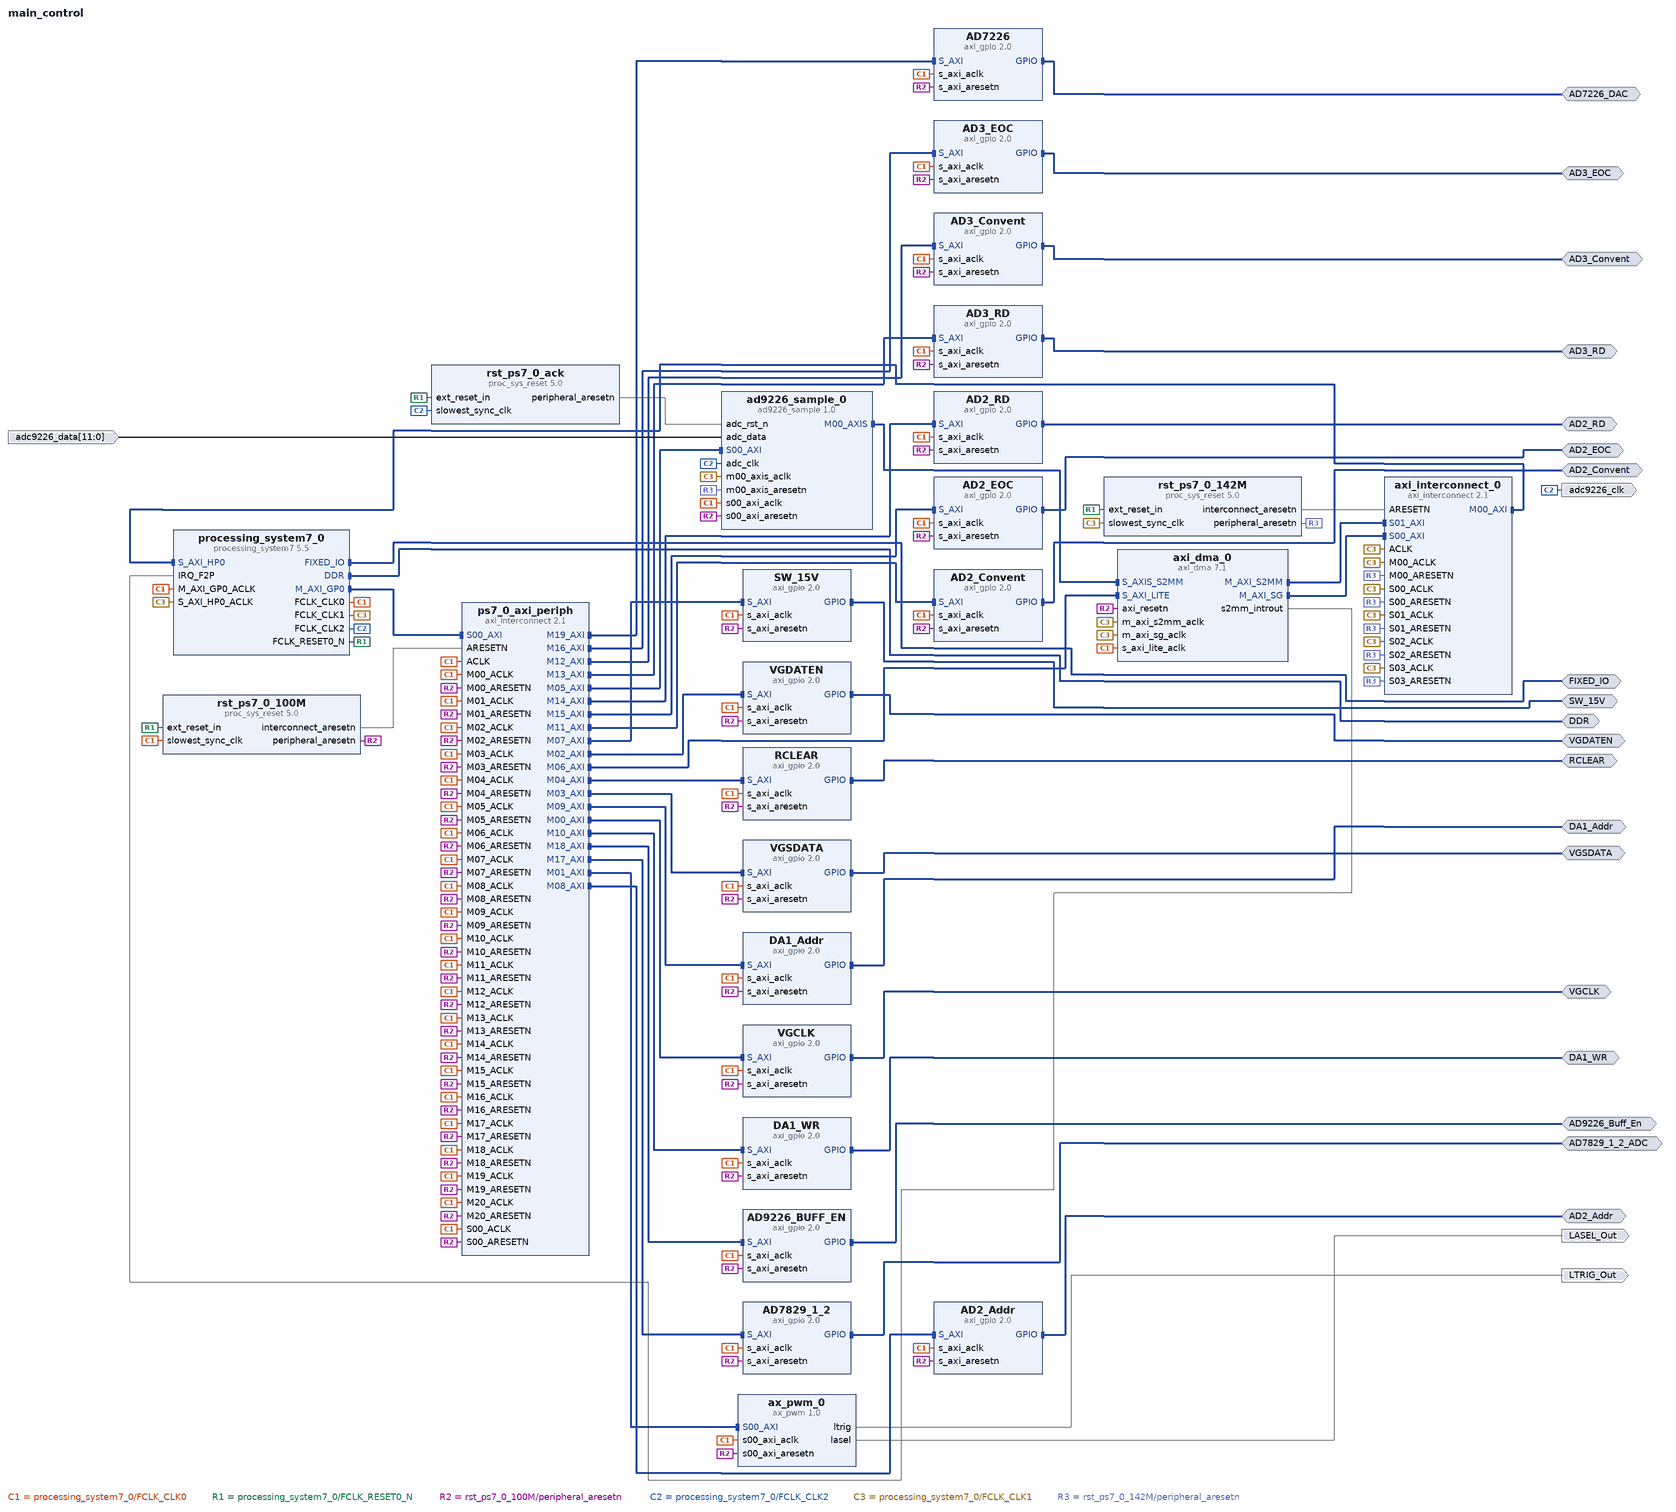
[diagram p0: block diagram of the top level]
# Vivado block design main_control, xc7z020clg484-2, Vivado 2018.3
create_bd_design main_control

create_bd_intf_port -mode Master -vlnv xilinx.com:interface:ddrx_rtl:1.0 DDR
create_bd_intf_port -mode Master -vlnv xilinx.com:display_processing_system7:fixedio_rtl:1.0 FIXED_IO
create_bd_intf_port -mode Master -vlnv xilinx.com:interface:gpio_rtl:1.0 VGCLK
create_bd_intf_port -mode Master -vlnv xilinx.com:interface:gpio_rtl:1.0 VGDATEN
create_bd_intf_port -mode Master -vlnv xilinx.com:interface:gpio_rtl:1.0 VGSDATA
create_bd_intf_port -mode Master -vlnv xilinx.com:interface:gpio_rtl:1.0 RCLEAR
create_bd_intf_port -mode Master -vlnv xilinx.com:interface:gpio_rtl:1.0 SW_15V
create_bd_intf_port -mode Master -vlnv xilinx.com:interface:gpio_rtl:1.0 AD2_Addr
create_bd_intf_port -mode Master -vlnv xilinx.com:interface:gpio_rtl:1.0 DA1_Addr
create_bd_intf_port -mode Master -vlnv xilinx.com:interface:gpio_rtl:1.0 DA1_WR
create_bd_intf_port -mode Master -vlnv xilinx.com:interface:gpio_rtl:1.0 AD2_Convent
create_bd_intf_port -mode Master -vlnv xilinx.com:interface:gpio_rtl:1.0 AD2_RD
create_bd_intf_port -mode Master -vlnv xilinx.com:interface:gpio_rtl:1.0 AD2_EOC
create_bd_intf_port -mode Master -vlnv xilinx.com:interface:gpio_rtl:1.0 AD3_RD
create_bd_intf_port -mode Master -vlnv xilinx.com:interface:gpio_rtl:1.0 AD3_EOC
create_bd_intf_port -mode Master -vlnv xilinx.com:interface:gpio_rtl:1.0 AD3_Convent
create_bd_intf_port -mode Master -vlnv xilinx.com:interface:gpio_rtl:1.0 AD7226_DAC
create_bd_intf_port -mode Master -vlnv xilinx.com:interface:gpio_rtl:1.0 AD7829_1_2_ADC
create_bd_intf_port -mode Master -vlnv xilinx.com:interface:gpio_rtl:1.0 AD9226_Buff_En
create_bd_port -dir I -from 11 -to 0 adc9226_data
create_bd_port -dir O -type clk adc9226_clk
set_property -dict {CONFIG.FREQ_HZ 40000000} [get_bd_ports adc9226_clk]
create_bd_port -dir O LTRIG_Out
create_bd_port -dir O LASEL_Out

create_bd_cell -type ip -vlnv xilinx.com:ip:processing_system7:5.5 processing_system7_0
set_property -dict [list \
  CONFIG.PCW_EN_CLK1_PORT 1 \
  CONFIG.PCW_EN_CLK2_PORT 1 \
  CONFIG.PCW_FCLK_CLK1_BUF TRUE \
  CONFIG.PCW_FCLK_CLK2_BUF TRUE \
  CONFIG.PCW_FPGA0_PERIPHERAL_FREQMHZ 100 \
  CONFIG.PCW_FPGA1_PERIPHERAL_FREQMHZ 142 \
  CONFIG.PCW_FPGA2_PERIPHERAL_FREQMHZ 40 \
  CONFIG.PCW_FPGA_FCLK1_ENABLE 1 \
  CONFIG.PCW_FPGA_FCLK2_ENABLE 1 \
  CONFIG.PCW_GPIO_MIO_GPIO_ENABLE 0 \
  CONFIG.PCW_I2C0_GRP_INT_ENABLE 0 \
  CONFIG.PCW_I2C0_I2C0_IO {MIO 10 .. 11} \
  CONFIG.PCW_I2C0_PERIPHERAL_ENABLE 1 \
  CONFIG.PCW_I2C_PERIPHERAL_FREQMHZ 111.111115 \
  CONFIG.PCW_IRQ_F2P_INTR 1 \
  CONFIG.PCW_PRESET_BANK1_VOLTAGE {LVCMOS 1.8V} \
  CONFIG.PCW_QSPI_GRP_SINGLE_SS_ENABLE 1 \
  CONFIG.PCW_QSPI_GRP_SINGLE_SS_IO {MIO 1 .. 6} \
  CONFIG.PCW_QSPI_PERIPHERAL_ENABLE 1 \
  CONFIG.PCW_QSPI_QSPI_IO {MIO 1 .. 6} \
  CONFIG.PCW_SINGLE_QSPI_DATA_MODE x4 \
  CONFIG.PCW_UART1_PERIPHERAL_ENABLE 1 \
  CONFIG.PCW_UART1_UART1_IO {MIO 12 .. 13} \
  CONFIG.PCW_UART_PERIPHERAL_FREQMHZ 100 \
  CONFIG.PCW_UIPARAM_DDR_PARTNO {MT41J256M16 RE-125} \
  CONFIG.PCW_USE_FABRIC_INTERRUPT 1 \
  CONFIG.PCW_USE_S_AXI_HP0 1 \
] [get_bd_cells processing_system7_0]
# 68 more settings of processing_system7_0 are not shown: defaults, MIO pin electricals, DDR timing, and values the tool derives
create_bd_cell -type ip -vlnv xilinx.com:ip:axi_gpio:2.0 VGCLK
set_property -dict {CONFIG.C_ALL_OUTPUTS 1 CONFIG.C_GPIO_WIDTH 1} [get_bd_cells VGCLK]
create_bd_cell -type ip -vlnv xilinx.com:ip:axi_interconnect:2.1 ps7_0_axi_periph
set_property -dict {CONFIG.NUM_MI 21} [get_bd_cells ps7_0_axi_periph]
create_bd_cell -type ip -vlnv xilinx.com:ip:proc_sys_reset:5.0 rst_ps7_0_100M
create_bd_cell -type ip -vlnv xilinx.com:ip:axi_gpio:2.0 VGDATEN
set_property -dict {CONFIG.C_ALL_OUTPUTS 1 CONFIG.C_GPIO_WIDTH 1} [get_bd_cells VGDATEN]
create_bd_cell -type ip -vlnv xilinx.com:ip:axi_gpio:2.0 VGSDATA
set_property -dict {CONFIG.C_ALL_OUTPUTS 1 CONFIG.C_GPIO_WIDTH 1} [get_bd_cells VGSDATA]
create_bd_cell -type ip -vlnv xilinx.com:ip:axi_gpio:2.0 RCLEAR
set_property -dict {CONFIG.C_ALL_OUTPUTS 1 CONFIG.C_GPIO_WIDTH 1} [get_bd_cells RCLEAR]
create_bd_cell -type ip -vlnv xilinx.com:ip:axi_dma:7.1 axi_dma_0
set_property -dict [list \
  CONFIG.c_include_mm2s 0 \
  CONFIG.c_m_axi_s2mm_data_width 64 \
  CONFIG.c_s2mm_burst_size 128 \
  CONFIG.c_sg_include_stscntrl_strm 0 \
  CONFIG.c_sg_length_width 23 \
] [get_bd_cells axi_dma_0]
create_bd_cell -type ip -vlnv xilinx.com:ip:axi_interconnect:2.1 axi_interconnect_0
set_property -dict {CONFIG.NUM_MI 1 CONFIG.NUM_SI 4} [get_bd_cells axi_interconnect_0]
create_bd_cell -type ip -vlnv xilinx.com:ip:proc_sys_reset:5.0 rst_ps7_0_ack
create_bd_cell -type ip -vlnv xilinx.com:ip:proc_sys_reset:5.0 rst_ps7_0_142M
create_bd_cell -type ip -vlnv xilinx.com:ip:axi_gpio:2.0 SW_15V
set_property -dict {CONFIG.C_ALL_OUTPUTS 1 CONFIG.C_GPIO_WIDTH 1} [get_bd_cells SW_15V]
create_bd_cell -type ip -vlnv xilinx.com:ip:axi_gpio:2.0 AD2_Addr
set_property -dict {CONFIG.C_ALL_OUTPUTS 0 CONFIG.C_GPIO_WIDTH 3} [get_bd_cells AD2_Addr]
create_bd_cell -type ip -vlnv xilinx.com:ip:axi_gpio:2.0 DA1_Addr
set_property -dict {CONFIG.C_ALL_OUTPUTS 0 CONFIG.C_GPIO_WIDTH 2} [get_bd_cells DA1_Addr]
create_bd_cell -type ip -vlnv xilinx.com:ip:axi_gpio:2.0 DA1_WR
set_property -dict {CONFIG.C_ALL_OUTPUTS 0 CONFIG.C_GPIO_WIDTH 1} [get_bd_cells DA1_WR]
create_bd_cell -type ip -vlnv xilinx.com:ip:axi_gpio:2.0 AD2_Convent
set_property -dict {CONFIG.C_ALL_OUTPUTS 0 CONFIG.C_GPIO_WIDTH 1} [get_bd_cells AD2_Convent]
create_bd_cell -type ip -vlnv xilinx.com:ip:axi_gpio:2.0 AD3_Convent
set_property -dict {CONFIG.C_ALL_OUTPUTS 0 CONFIG.C_GPIO_WIDTH 1} [get_bd_cells AD3_Convent]
create_bd_cell -type ip -vlnv xilinx.com:ip:axi_gpio:2.0 AD3_RD
set_property -dict {CONFIG.C_ALL_OUTPUTS 0 CONFIG.C_GPIO_WIDTH 1} [get_bd_cells AD3_RD]
create_bd_cell -type ip -vlnv xilinx.com:ip:axi_gpio:2.0 AD2_RD
set_property -dict {CONFIG.C_ALL_OUTPUTS 0 CONFIG.C_GPIO_WIDTH 1} [get_bd_cells AD2_RD]
create_bd_cell -type ip -vlnv xilinx.com:ip:axi_gpio:2.0 AD2_EOC
set_property -dict {CONFIG.C_ALL_OUTPUTS 0 CONFIG.C_GPIO_WIDTH 1} [get_bd_cells AD2_EOC]
create_bd_cell -type ip -vlnv xilinx.com:ip:axi_gpio:2.0 AD3_EOC
set_property -dict {CONFIG.C_ALL_OUTPUTS 0 CONFIG.C_GPIO_WIDTH 1} [get_bd_cells AD3_EOC]
create_bd_cell -type ip -vlnv xilinx.com:user:ad9226_sample:1.0 ad9226_sample_0
create_bd_cell -type ip -vlnv xilinx.com:ip:axi_gpio:2.0 AD7829_1_2
set_property -dict {CONFIG.C_ALL_OUTPUTS 0 CONFIG.C_GPIO_WIDTH 8} [get_bd_cells AD7829_1_2]
create_bd_cell -type ip -vlnv xilinx.com:ip:axi_gpio:2.0 AD7226
set_property -dict {CONFIG.C_ALL_OUTPUTS 0 CONFIG.C_GPIO_WIDTH 8} [get_bd_cells AD7226]
create_bd_cell -type ip -vlnv xilinx.com:ip:axi_gpio:2.0 AD9226_BUFF_EN
set_property -dict {CONFIG.C_ALL_OUTPUTS 0 CONFIG.C_GPIO_WIDTH 1} [get_bd_cells AD9226_BUFF_EN]
create_bd_cell -type ip -vlnv LSP:user:ax_pwm:1.0 ax_pwm_0

# ---- connections ----

connect_bd_intf_net [get_bd_intf_ports SW_15V] [get_bd_intf_pins SW_15V/GPIO]
connect_bd_intf_net [get_bd_intf_pins axi_dma_0/M_AXI_S2MM] [get_bd_intf_pins axi_interconnect_0/S01_AXI]
connect_bd_intf_net [get_bd_intf_pins ps7_0_axi_periph/M04_AXI] [get_bd_intf_pins RCLEAR/S_AXI]
connect_bd_intf_net -intf_net axi_gpio_3_GPIO [get_bd_intf_ports RCLEAR] [get_bd_intf_pins RCLEAR/GPIO]
connect_bd_intf_net [get_bd_intf_pins ps7_0_axi_periph/M18_AXI] [get_bd_intf_pins AD9226_BUFF_EN/S_AXI]
connect_bd_intf_net [get_bd_intf_pins ps7_0_axi_periph/M07_AXI] [get_bd_intf_pins SW_15V/S_AXI]
connect_bd_intf_net -intf_net AD7829_1_GPIO [get_bd_intf_ports AD7829_1_2_ADC] [get_bd_intf_pins AD7829_1_2/GPIO]
connect_bd_intf_net [get_bd_intf_ports AD3_Convent] [get_bd_intf_pins AD3_Convent/GPIO]
connect_bd_intf_net -intf_net AD2_Convent1_GPIO [get_bd_intf_ports AD9226_Buff_En] [get_bd_intf_pins AD9226_BUFF_EN/GPIO]
connect_bd_intf_net [get_bd_intf_pins ps7_0_axi_periph/M14_AXI] [get_bd_intf_pins AD2_RD/S_AXI]
connect_bd_intf_net [get_bd_intf_pins ps7_0_axi_periph/M15_AXI] [get_bd_intf_pins AD2_EOC/S_AXI]
connect_bd_intf_net [get_bd_intf_pins ps7_0_axi_periph/M02_AXI] [get_bd_intf_pins VGDATEN/S_AXI]
connect_bd_intf_net [get_bd_intf_pins ps7_0_axi_periph/M01_AXI] [get_bd_intf_pins ax_pwm_0/S00_AXI]
connect_bd_intf_net [get_bd_intf_ports DA1_Addr] [get_bd_intf_pins DA1_Addr/GPIO]
connect_bd_intf_net [get_bd_intf_pins axi_dma_0/S_AXI_LITE] [get_bd_intf_pins ps7_0_axi_periph/M06_AXI]
connect_bd_intf_net [get_bd_intf_ports AD2_Convent] [get_bd_intf_pins AD2_Convent/GPIO]
connect_bd_intf_net -intf_net axi_gpio_1_GPIO [get_bd_intf_ports VGDATEN] [get_bd_intf_pins VGDATEN/GPIO]
connect_bd_intf_net [get_bd_intf_ports AD2_RD] [get_bd_intf_pins AD2_RD/GPIO]
connect_bd_intf_net [get_bd_intf_pins axi_interconnect_0/M00_AXI] [get_bd_intf_pins processing_system7_0/S_AXI_HP0]
connect_bd_intf_net [get_bd_intf_pins ps7_0_axi_periph/M09_AXI] [get_bd_intf_pins DA1_Addr/S_AXI]
connect_bd_intf_net [get_bd_intf_pins ad9226_sample_0/M00_AXIS] [get_bd_intf_pins axi_dma_0/S_AXIS_S2MM]
connect_bd_intf_net [get_bd_intf_pins ps7_0_axi_periph/M19_AXI] [get_bd_intf_pins AD7226/S_AXI]
connect_bd_intf_net [get_bd_intf_pins ps7_0_axi_periph/M08_AXI] [get_bd_intf_pins AD2_Addr/S_AXI]
connect_bd_intf_net [get_bd_intf_ports DA1_WR] [get_bd_intf_pins DA1_WR/GPIO]
connect_bd_intf_net [get_bd_intf_ports AD2_EOC] [get_bd_intf_pins AD2_EOC/GPIO]
connect_bd_intf_net [get_bd_intf_pins ps7_0_axi_periph/M11_AXI] [get_bd_intf_pins AD2_Convent/S_AXI]
connect_bd_intf_net [get_bd_intf_ports AD7226_DAC] [get_bd_intf_pins AD7226/GPIO]
connect_bd_intf_net [get_bd_intf_ports FIXED_IO] [get_bd_intf_pins processing_system7_0/FIXED_IO]
connect_bd_intf_net [get_bd_intf_ports AD2_Addr] [get_bd_intf_pins AD2_Addr/GPIO]
connect_bd_intf_net [get_bd_intf_pins ps7_0_axi_periph/M00_AXI] [get_bd_intf_pins VGCLK/S_AXI]
connect_bd_intf_net [get_bd_intf_ports AD3_EOC] [get_bd_intf_pins AD3_EOC/GPIO]
connect_bd_intf_net [get_bd_intf_pins ps7_0_axi_periph/M03_AXI] [get_bd_intf_pins VGSDATA/S_AXI]
connect_bd_intf_net [get_bd_intf_pins ps7_0_axi_periph/M10_AXI] [get_bd_intf_pins DA1_WR/S_AXI]
connect_bd_intf_net [get_bd_intf_pins ps7_0_axi_periph/M17_AXI] [get_bd_intf_pins AD7829_1_2/S_AXI]
connect_bd_intf_net [get_bd_intf_pins ps7_0_axi_periph/M13_AXI] [get_bd_intf_pins AD3_RD/S_AXI]
connect_bd_intf_net -intf_net axi_gpio_2_GPIO [get_bd_intf_ports VGSDATA] [get_bd_intf_pins VGSDATA/GPIO]
connect_bd_intf_net [get_bd_intf_ports DDR] [get_bd_intf_pins processing_system7_0/DDR]
connect_bd_intf_net [get_bd_intf_ports AD3_RD] [get_bd_intf_pins AD3_RD/GPIO]
connect_bd_intf_net -intf_net axi_gpio_0_GPIO [get_bd_intf_ports VGCLK] [get_bd_intf_pins VGCLK/GPIO]
connect_bd_intf_net [get_bd_intf_pins ps7_0_axi_periph/M05_AXI] [get_bd_intf_pins ad9226_sample_0/S00_AXI]
connect_bd_intf_net [get_bd_intf_pins axi_dma_0/M_AXI_SG] [get_bd_intf_pins axi_interconnect_0/S00_AXI]
connect_bd_intf_net [get_bd_intf_pins ps7_0_axi_periph/M12_AXI] [get_bd_intf_pins AD3_Convent/S_AXI]
connect_bd_intf_net [get_bd_intf_pins processing_system7_0/M_AXI_GP0] [get_bd_intf_pins ps7_0_axi_periph/S00_AXI]
connect_bd_intf_net [get_bd_intf_pins ps7_0_axi_periph/M16_AXI] [get_bd_intf_pins AD3_EOC/S_AXI]
connect_bd_net [get_bd_pins processing_system7_0/FCLK_CLK0] \
  [get_bd_pins processing_system7_0/M_AXI_GP0_ACLK] [get_bd_pins ps7_0_axi_periph/S00_ACLK] \
  [get_bd_pins rst_ps7_0_100M/slowest_sync_clk] [get_bd_pins VGCLK/s_axi_aclk] [get_bd_pins ps7_0_axi_periph/M00_ACLK] \
  [get_bd_pins ps7_0_axi_periph/ACLK] [get_bd_pins VGDATEN/s_axi_aclk] [get_bd_pins ps7_0_axi_periph/M02_ACLK] \
  [get_bd_pins VGSDATA/s_axi_aclk] [get_bd_pins ps7_0_axi_periph/M03_ACLK] [get_bd_pins RCLEAR/s_axi_aclk] \
  [get_bd_pins ps7_0_axi_periph/M04_ACLK] [get_bd_pins axi_dma_0/s_axi_lite_aclk] [get_bd_pins ps7_0_axi_periph/M05_ACLK] \
  [get_bd_pins ps7_0_axi_periph/M06_ACLK] [get_bd_pins SW_15V/s_axi_aclk] [get_bd_pins ps7_0_axi_periph/M07_ACLK] \
  [get_bd_pins AD2_Addr/s_axi_aclk] [get_bd_pins ps7_0_axi_periph/M08_ACLK] [get_bd_pins DA1_Addr/s_axi_aclk] \
  [get_bd_pins ps7_0_axi_periph/M09_ACLK] [get_bd_pins DA1_WR/s_axi_aclk] [get_bd_pins ps7_0_axi_periph/M10_ACLK] \
  [get_bd_pins AD3_Convent/s_axi_aclk] [get_bd_pins AD3_EOC/s_axi_aclk] [get_bd_pins AD3_RD/s_axi_aclk] \
  [get_bd_pins AD2_EOC/s_axi_aclk] [get_bd_pins AD2_RD/s_axi_aclk] [get_bd_pins AD2_Convent/s_axi_aclk] \
  [get_bd_pins ps7_0_axi_periph/M11_ACLK] [get_bd_pins ps7_0_axi_periph/M12_ACLK] [get_bd_pins ps7_0_axi_periph/M13_ACLK] \
  [get_bd_pins ps7_0_axi_periph/M14_ACLK] [get_bd_pins ps7_0_axi_periph/M15_ACLK] [get_bd_pins ps7_0_axi_periph/M16_ACLK] \
  [get_bd_pins ps7_0_axi_periph/M17_ACLK] [get_bd_pins ps7_0_axi_periph/M18_ACLK] [get_bd_pins ad9226_sample_0/s00_axi_aclk] \
  [get_bd_pins AD7829_1_2/s_axi_aclk] [get_bd_pins AD7226/s_axi_aclk] [get_bd_pins ps7_0_axi_periph/M19_ACLK] \
  [get_bd_pins AD9226_BUFF_EN/s_axi_aclk] [get_bd_pins ps7_0_axi_periph/M20_ACLK] [get_bd_pins ps7_0_axi_periph/M01_ACLK] \
  [get_bd_pins ax_pwm_0/s00_axi_aclk]
connect_bd_net [get_bd_pins processing_system7_0/FCLK_RESET0_N] \
  [get_bd_pins rst_ps7_0_100M/ext_reset_in] [get_bd_pins rst_ps7_0_ack/ext_reset_in] \
  [get_bd_pins rst_ps7_0_142M/ext_reset_in]
connect_bd_net -net rst_ps7_0_50M_peripheral_aresetn [get_bd_pins rst_ps7_0_100M/peripheral_aresetn] \
  [get_bd_pins ps7_0_axi_periph/S00_ARESETN] [get_bd_pins VGCLK/s_axi_aresetn] [get_bd_pins ps7_0_axi_periph/M00_ARESETN] \
  [get_bd_pins VGDATEN/s_axi_aresetn] [get_bd_pins ps7_0_axi_periph/M02_ARESETN] [get_bd_pins VGSDATA/s_axi_aresetn] \
  [get_bd_pins ps7_0_axi_periph/M03_ARESETN] [get_bd_pins RCLEAR/s_axi_aresetn] [get_bd_pins ps7_0_axi_periph/M04_ARESETN] \
  [get_bd_pins ps7_0_axi_periph/M05_ARESETN] [get_bd_pins ps7_0_axi_periph/M06_ARESETN] [get_bd_pins SW_15V/s_axi_aresetn] \
  [get_bd_pins ps7_0_axi_periph/M07_ARESETN] [get_bd_pins AD2_Addr/s_axi_aresetn] [get_bd_pins ps7_0_axi_periph/M08_ARESETN] \
  [get_bd_pins DA1_Addr/s_axi_aresetn] [get_bd_pins ps7_0_axi_periph/M09_ARESETN] [get_bd_pins DA1_WR/s_axi_aresetn] \
  [get_bd_pins ps7_0_axi_periph/M10_ARESETN] [get_bd_pins AD3_Convent/s_axi_aresetn] [get_bd_pins AD3_EOC/s_axi_aresetn] \
  [get_bd_pins AD3_RD/s_axi_aresetn] [get_bd_pins AD2_EOC/s_axi_aresetn] [get_bd_pins AD2_RD/s_axi_aresetn] \
  [get_bd_pins AD2_Convent/s_axi_aresetn] [get_bd_pins ps7_0_axi_periph/M11_ARESETN] \
  [get_bd_pins ps7_0_axi_periph/M12_ARESETN] [get_bd_pins ps7_0_axi_periph/M13_ARESETN] \
  [get_bd_pins ps7_0_axi_periph/M14_ARESETN] [get_bd_pins ps7_0_axi_periph/M15_ARESETN] \
  [get_bd_pins ps7_0_axi_periph/M16_ARESETN] [get_bd_pins axi_dma_0/axi_resetn] [get_bd_pins ps7_0_axi_periph/M17_ARESETN] \
  [get_bd_pins ps7_0_axi_periph/M18_ARESETN] [get_bd_pins ad9226_sample_0/s00_axi_aresetn] \
  [get_bd_pins AD7829_1_2/s_axi_aresetn] [get_bd_pins AD7226/s_axi_aresetn] [get_bd_pins ps7_0_axi_periph/M19_ARESETN] \
  [get_bd_pins AD9226_BUFF_EN/s_axi_aresetn] [get_bd_pins ps7_0_axi_periph/M20_ARESETN] \
  [get_bd_pins ps7_0_axi_periph/M01_ARESETN] [get_bd_pins ax_pwm_0/s00_axi_aresetn]
connect_bd_net [get_bd_ports adc9226_data] [get_bd_pins ad9226_sample_0/adc_data]
connect_bd_net [get_bd_pins processing_system7_0/FCLK_CLK2] \
  [get_bd_pins rst_ps7_0_ack/slowest_sync_clk] [get_bd_ports adc9226_clk] [get_bd_pins ad9226_sample_0/adc_clk]
connect_bd_net -net rst_ps7_0_40M_peripheral_aresetn [get_bd_pins rst_ps7_0_ack/peripheral_aresetn] [get_bd_pins ad9226_sample_0/adc_rst_n]
connect_bd_net [get_bd_pins processing_system7_0/FCLK_CLK1] \
  [get_bd_pins axi_dma_0/m_axi_sg_aclk] [get_bd_pins axi_interconnect_0/S00_ACLK] \
  [get_bd_pins rst_ps7_0_142M/slowest_sync_clk] [get_bd_pins axi_dma_0/m_axi_s2mm_aclk] \
  [get_bd_pins axi_interconnect_0/S01_ACLK] [get_bd_pins processing_system7_0/S_AXI_HP0_ACLK] \
  [get_bd_pins axi_interconnect_0/ACLK] [get_bd_pins axi_interconnect_0/M00_ACLK] [get_bd_pins axi_interconnect_0/S02_ACLK] \
  [get_bd_pins axi_interconnect_0/S03_ACLK] [get_bd_pins ad9226_sample_0/m00_axis_aclk]
connect_bd_net [get_bd_pins rst_ps7_0_142M/peripheral_aresetn] \
  [get_bd_pins axi_interconnect_0/S00_ARESETN] [get_bd_pins axi_interconnect_0/S01_ARESETN] \
  [get_bd_pins axi_interconnect_0/M00_ARESETN] [get_bd_pins axi_interconnect_0/S02_ARESETN] \
  [get_bd_pins axi_interconnect_0/S03_ARESETN] [get_bd_pins ad9226_sample_0/m00_axis_aresetn]
connect_bd_net [get_bd_pins rst_ps7_0_142M/interconnect_aresetn] [get_bd_pins axi_interconnect_0/ARESETN]
connect_bd_net [get_bd_pins rst_ps7_0_100M/interconnect_aresetn] [get_bd_pins ps7_0_axi_periph/ARESETN]
connect_bd_net [get_bd_pins axi_dma_0/s2mm_introut] [get_bd_pins processing_system7_0/IRQ_F2P]
connect_bd_net [get_bd_pins ax_pwm_0/ltrig] [get_bd_ports LTRIG_Out]
connect_bd_net [get_bd_pins ax_pwm_0/lasel] [get_bd_ports LASEL_Out]

# ---- address map ----
assign_bd_address -offset 0x00000000 -range 1G -target_address_space [get_bd_addr_spaces axi_dma_0/Data_S2MM] [get_bd_addr_segs processing_system7_0/S_AXI_HP0/HP0_DDR_LOWOCM]
assign_bd_address -offset 0x00000000 -range 1G -target_address_space [get_bd_addr_spaces axi_dma_0/Data_SG] [get_bd_addr_segs processing_system7_0/S_AXI_HP0/HP0_DDR_LOWOCM]
assign_bd_address -offset 0x40400000 -range 64K -target_address_space [get_bd_addr_spaces processing_system7_0/Data] [get_bd_addr_segs axi_dma_0/S_AXI_LITE/Reg]
assign_bd_address -offset 0x41200000 -range 4K -target_address_space [get_bd_addr_spaces processing_system7_0/Data] [get_bd_addr_segs VGCLK/S_AXI/Reg]
assign_bd_address -offset 0x41210000 -range 4K -target_address_space [get_bd_addr_spaces processing_system7_0/Data] [get_bd_addr_segs VGDATEN/S_AXI/Reg]
assign_bd_address -offset 0x41220000 -range 4K -target_address_space [get_bd_addr_spaces processing_system7_0/Data] [get_bd_addr_segs VGSDATA/S_AXI/Reg]
assign_bd_address -offset 0x41230000 -range 4K -target_address_space [get_bd_addr_spaces processing_system7_0/Data] [get_bd_addr_segs RCLEAR/S_AXI/Reg]
assign_bd_address -offset 0x41240000 -range 4K -target_address_space [get_bd_addr_spaces processing_system7_0/Data] [get_bd_addr_segs SW_15V/S_AXI/Reg]
assign_bd_address -offset 0x41250000 -range 4K -target_address_space [get_bd_addr_spaces processing_system7_0/Data] [get_bd_addr_segs AD2_Addr/S_AXI/Reg]
assign_bd_address -offset 0x41260000 -range 4K -target_address_space [get_bd_addr_spaces processing_system7_0/Data] [get_bd_addr_segs DA1_Addr/S_AXI/Reg]
assign_bd_address -offset 0x41270000 -range 4K -target_address_space [get_bd_addr_spaces processing_system7_0/Data] [get_bd_addr_segs DA1_WR/S_AXI/Reg]
assign_bd_address -offset 0x41280000 -range 4K -target_address_space [get_bd_addr_spaces processing_system7_0/Data] [get_bd_addr_segs AD2_Convent/S_AXI/Reg]
assign_bd_address -offset 0x41290000 -range 4K -target_address_space [get_bd_addr_spaces processing_system7_0/Data] [get_bd_addr_segs AD3_Convent/S_AXI/Reg]
assign_bd_address -offset 0x412A0000 -range 4K -target_address_space [get_bd_addr_spaces processing_system7_0/Data] [get_bd_addr_segs AD3_RD/S_AXI/Reg]
assign_bd_address -offset 0x412B0000 -range 4K -target_address_space [get_bd_addr_spaces processing_system7_0/Data] [get_bd_addr_segs AD2_RD/S_AXI/Reg]
assign_bd_address -offset 0x412C0000 -range 4K -target_address_space [get_bd_addr_spaces processing_system7_0/Data] [get_bd_addr_segs AD2_EOC/S_AXI/Reg]
assign_bd_address -offset 0x412D0000 -range 4K -target_address_space [get_bd_addr_spaces processing_system7_0/Data] [get_bd_addr_segs AD3_EOC/S_AXI/Reg]
assign_bd_address -offset 0x412E0000 -range 64K -target_address_space [get_bd_addr_spaces processing_system7_0/Data] [get_bd_addr_segs AD7829_1_2/S_AXI/Reg]
assign_bd_address -offset 0x41300000 -range 64K -target_address_space [get_bd_addr_spaces processing_system7_0/Data] [get_bd_addr_segs AD7226/S_AXI/Reg]
assign_bd_address -offset 0x41310000 -range 64K -target_address_space [get_bd_addr_spaces processing_system7_0/Data] [get_bd_addr_segs AD9226_BUFF_EN/S_AXI/Reg]
assign_bd_address -offset 0x43C00000 -range 64K -target_address_space [get_bd_addr_spaces processing_system7_0/Data] [get_bd_addr_segs ax_pwm_0/S00_AXI/S00_AXI_reg]
assign_bd_address -offset 0x43C10000 -range 64K -target_address_space [get_bd_addr_spaces processing_system7_0/Data] [get_bd_addr_segs ad9226_sample_0/S00_AXI/S00_AXI_reg]

validate_bd_design
save_bd_design
